# Altium schematic sheet Dev_Board.SchDoc
size B; SheetNumber: 1; SheetTotal: 1
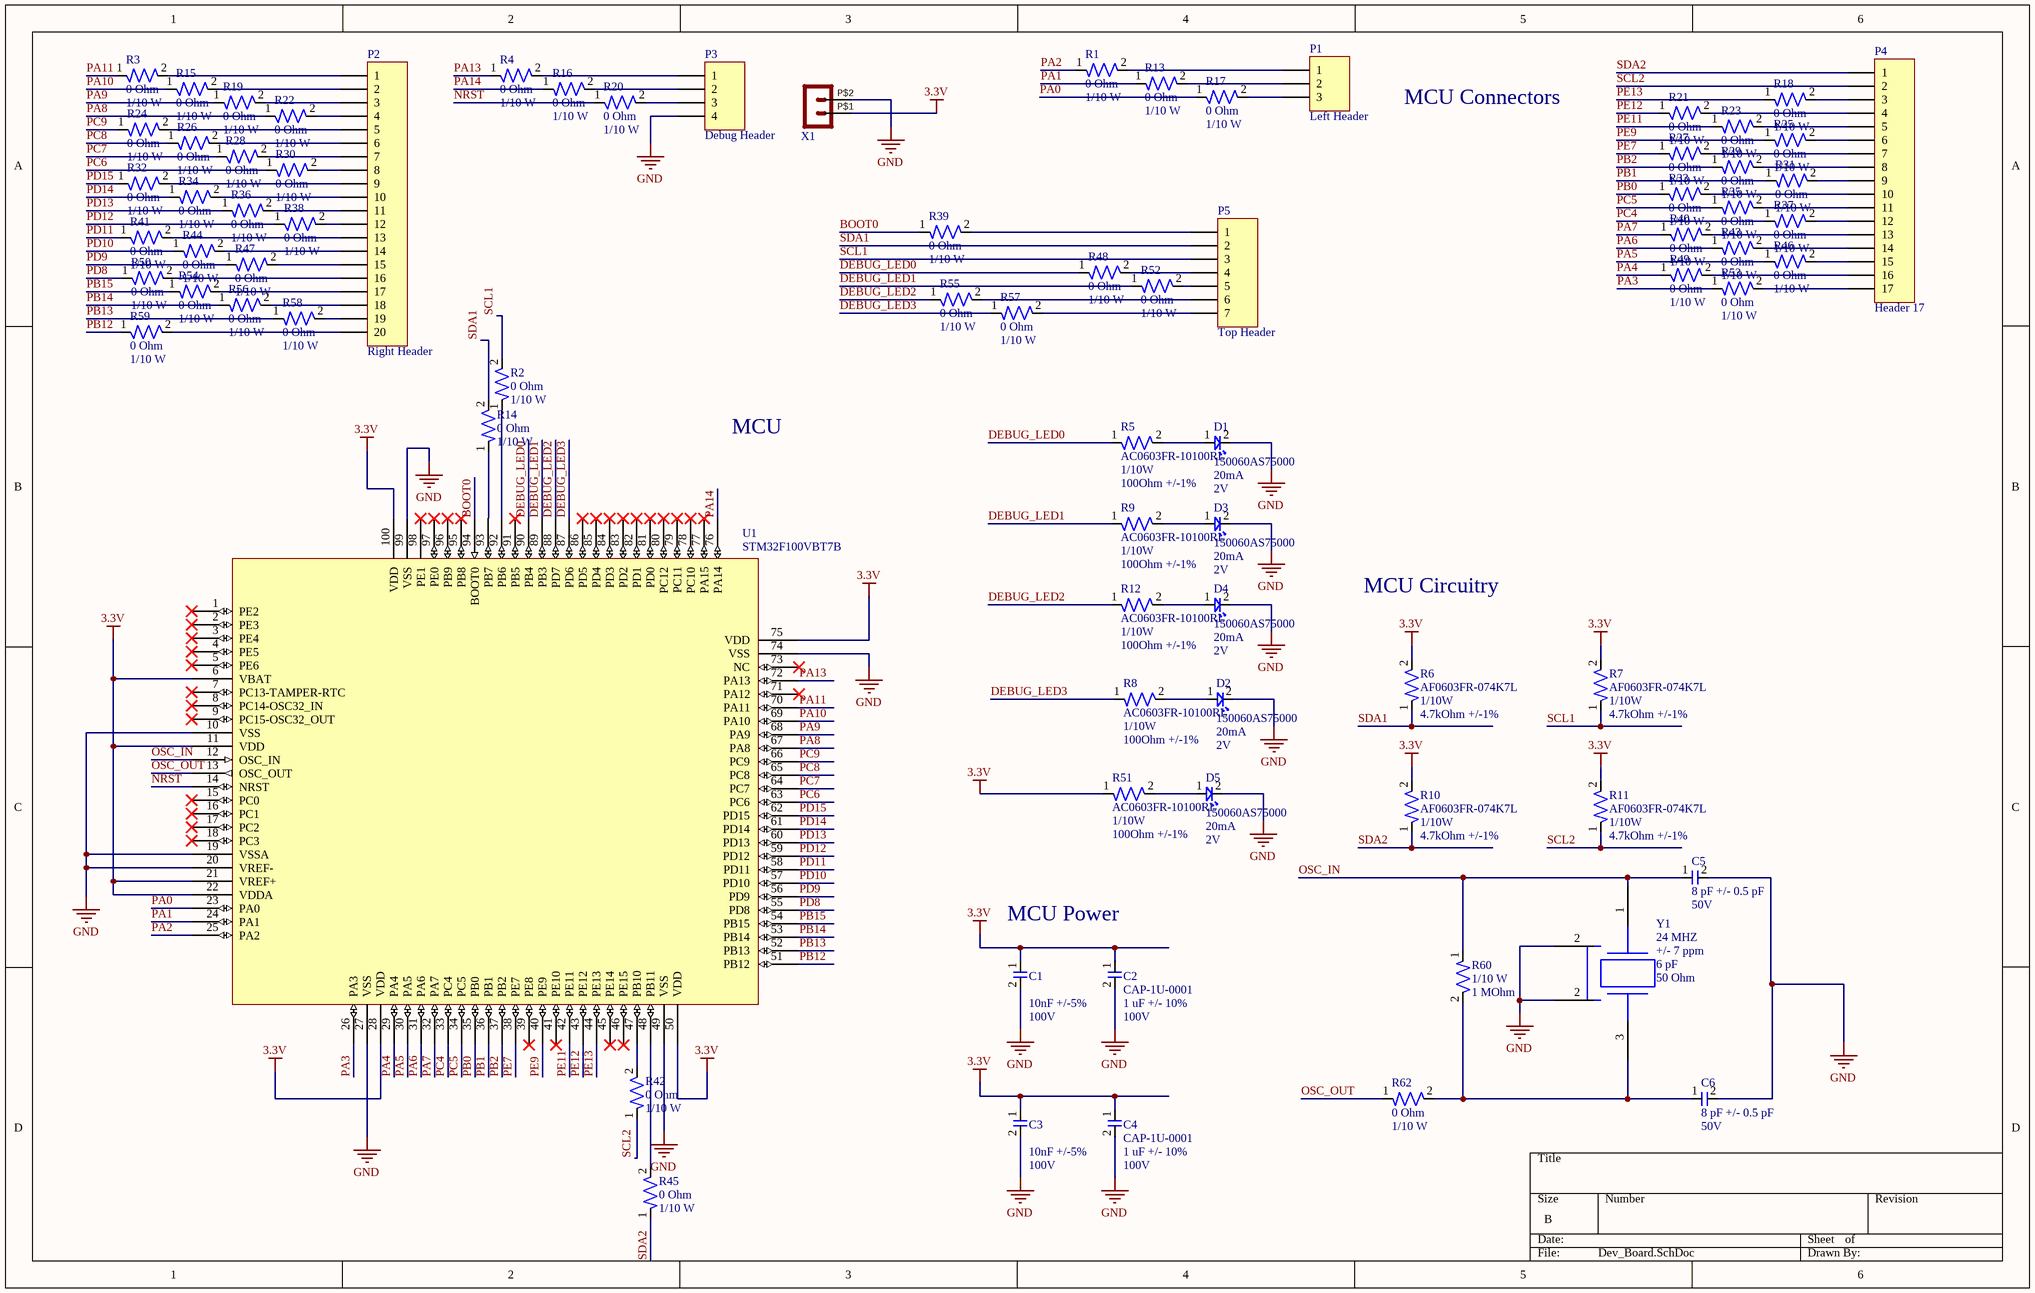
[diagram p0: Dev_Board.SchDoc]

## Parts
C1  Capacitance: 10nF +/-5%  Voltage Rating: 100V  [CAP-0603]  (hidden comment: C1608C0G2A103J080AC)
C2  CAP-1U-0001  Capacitance: 1 uF +/- 10%  Voltage: 100V  [CAP-1206 - duplicate]
C3  Capacitance: 10nF +/-5%  Voltage Rating: 100V  [CAP-0603]  (hidden comment: C1608C0G2A103J080AC)
C4  CAP-1U-0001  Capacitance: 1 uF +/- 10%  Voltage: 100V  [CAP-1206 - duplicate]
C5  Capacitance: 8 pF +/- 0.5 pF  Voltage: 50V  [CAP-0603]  (hidden comment: CC0603DRNPO9BN8R0)
C6  Capacitance: 8 pF +/- 0.5 pF  Voltage: 50V  [CAP-0603]  (hidden comment: CC0603DRNPO9BN8R0)
D1  150060AS75000  Current Rating: 20mA  Vf: 2V  [LED-0603]
D2  150060AS75000  Current Rating: 20mA  Vf: 2V  [LED-0603]
D3  150060AS75000  Current Rating: 20mA  Vf: 2V  [LED-0603]
D4  150060AS75000  Current Rating: 20mA  Vf: 2V  [LED-0603]
D5  150060AS75000  Current Rating: 20mA  Vf: 2V  [LED-0603]
P1  Left Header  [HDR1X3]
P2  Right Header  [HDR1X20]
P3  Debug Header  [HDR1X4]
P4  Header 17  [HDR1X17]
P5  Top Header  [HDR1X7]
R1  Resistance: 0 Ohm  Power: 1/10 W  [RES-0603]  (hidden comment: RMCF0603ZT0R00)
R2  Resistance: 0 Ohm  Power: 1/10 W  [RES-0603]  (hidden comment: RMCF0603ZT0R00)
R3  Resistance: 0 Ohm  Power: 1/10 W  [RES-0603]  (hidden comment: RMCF0603ZT0R00)
R4  Resistance: 0 Ohm  Power: 1/10 W  [RES-0603]  (hidden comment: RMCF0603ZT0R00)
R5  AC0603FR-10100RL  Power Rating: 1/10W  Resistance: 100Ohm +/-1%  [RES-0603]
R6  AF0603FR-074K7L  Power Rating: 1/10W  Resistance: 4.7kOhm +/-1%  [RES-0603]
R7  AF0603FR-074K7L  Power Rating: 1/10W  Resistance: 4.7kOhm +/-1%  [RES-0603]
R8  AC0603FR-10100RL  Power Rating: 1/10W  Resistance: 100Ohm +/-1%  [RES-0603]
R9  AC0603FR-10100RL  Power Rating: 1/10W  Resistance: 100Ohm +/-1%  [RES-0603]
R10  AF0603FR-074K7L  Power Rating: 1/10W  Resistance: 4.7kOhm +/-1%  [RES-0603]
R11  AF0603FR-074K7L  Power Rating: 1/10W  Resistance: 4.7kOhm +/-1%  [RES-0603]
R12  AC0603FR-10100RL  Power Rating: 1/10W  Resistance: 100Ohm +/-1%  [RES-0603]
R13  Resistance: 0 Ohm  Power: 1/10 W  [RES-0603]  (hidden comment: RMCF0603ZT0R00)
R14  Resistance: 0 Ohm  Power: 1/10 W  [RES-0603]  (hidden comment: RMCF0603ZT0R00)
R15  Resistance: 0 Ohm  Power: 1/10 W  [RES-0603]  (hidden comment: RMCF0603ZT0R00)
R16  Resistance: 0 Ohm  Power: 1/10 W  [RES-0603]  (hidden comment: RMCF0603ZT0R00)
R17  Resistance: 0 Ohm  Power: 1/10 W  [RES-0603]  (hidden comment: RMCF0603ZT0R00)
R18  Resistance: 0 Ohm  Power: 1/10 W  [RES-0603]  (hidden comment: RMCF0603ZT0R00)
R19  Resistance: 0 Ohm  Power: 1/10 W  [RES-0603]  (hidden comment: RMCF0603ZT0R00)
R20  Resistance: 0 Ohm  Power: 1/10 W  [RES-0603]  (hidden comment: RMCF0603ZT0R00)
R21  Resistance: 0 Ohm  Power: 1/10 W  [RES-0603]  (hidden comment: RMCF0603ZT0R00)
R22  Resistance: 0 Ohm  Power: 1/10 W  [RES-0603]  (hidden comment: RMCF0603ZT0R00)
R23  Resistance: 0 Ohm  Power: 1/10 W  [RES-0603]  (hidden comment: RMCF0603ZT0R00)
R24  Resistance: 0 Ohm  Power: 1/10 W  [RES-0603]  (hidden comment: RMCF0603ZT0R00)
R25  Resistance: 0 Ohm  Power: 1/10 W  [RES-0603]  (hidden comment: RMCF0603ZT0R00)
R26  Resistance: 0 Ohm  Power: 1/10 W  [RES-0603]  (hidden comment: RMCF0603ZT0R00)
R27  Resistance: 0 Ohm  Power: 1/10 W  [RES-0603]  (hidden comment: RMCF0603ZT0R00)
R28  Resistance: 0 Ohm  Power: 1/10 W  [RES-0603]  (hidden comment: RMCF0603ZT0R00)
R29  Resistance: 0 Ohm  Power: 1/10 W  [RES-0603]  (hidden comment: RMCF0603ZT0R00)
R30  Resistance: 0 Ohm  Power: 1/10 W  [RES-0603]  (hidden comment: RMCF0603ZT0R00)
R31  Resistance: 0 Ohm  Power: 1/10 W  [RES-0603]  (hidden comment: RMCF0603ZT0R00)
R32  Resistance: 0 Ohm  Power: 1/10 W  [RES-0603]  (hidden comment: RMCF0603ZT0R00)
R33  Resistance: 0 Ohm  Power: 1/10 W  [RES-0603]  (hidden comment: RMCF0603ZT0R00)
R34  Resistance: 0 Ohm  Power: 1/10 W  [RES-0603]  (hidden comment: RMCF0603ZT0R00)
R35  Resistance: 0 Ohm  Power: 1/10 W  [RES-0603]  (hidden comment: RMCF0603ZT0R00)
R36  Resistance: 0 Ohm  Power: 1/10 W  [RES-0603]  (hidden comment: RMCF0603ZT0R00)
R37  Resistance: 0 Ohm  Power: 1/10 W  [RES-0603]  (hidden comment: RMCF0603ZT0R00)
R38  Resistance: 0 Ohm  Power: 1/10 W  [RES-0603]  (hidden comment: RMCF0603ZT0R00)
R39  Resistance: 0 Ohm  Power: 1/10 W  [RES-0603]  (hidden comment: RMCF0603ZT0R00)
R40  Resistance: 0 Ohm  Power: 1/10 W  [RES-0603]  (hidden comment: RMCF0603ZT0R00)
R41  Resistance: 0 Ohm  Power: 1/10 W  [RES-0603]  (hidden comment: RMCF0603ZT0R00)
R42  Resistance: 0 Ohm  Power: 1/10 W  [RES-0603]  (hidden comment: RMCF0603ZT0R00)
R43  Resistance: 0 Ohm  Power: 1/10 W  [RES-0603]  (hidden comment: RMCF0603ZT0R00)
R44  Resistance: 0 Ohm  Power: 1/10 W  [RES-0603]  (hidden comment: RMCF0603ZT0R00)
R45  Resistance: 0 Ohm  Power: 1/10 W  [RES-0603]  (hidden comment: RMCF0603ZT0R00)
R46  Resistance: 0 Ohm  Power: 1/10 W  [RES-0603]  (hidden comment: RMCF0603ZT0R00)
R47  Resistance: 0 Ohm  Power: 1/10 W  [RES-0603]  (hidden comment: RMCF0603ZT0R00)
R48  Resistance: 0 Ohm  Power: 1/10 W  [RES-0603]  (hidden comment: RMCF0603ZT0R00)
R49  Resistance: 0 Ohm  Power: 1/10 W  [RES-0603]  (hidden comment: RMCF0603ZT0R00)
R50  Resistance: 0 Ohm  Power: 1/10 W  [RES-0603]  (hidden comment: RMCF0603ZT0R00)
R51  AC0603FR-10100RL  Power Rating: 1/10W  Resistance: 100Ohm +/-1%  [RES-0603]
R52  Resistance: 0 Ohm  Power: 1/10 W  [RES-0603]  (hidden comment: RMCF0603ZT0R00)
R53  Resistance: 0 Ohm  Power: 1/10 W  [RES-0603]  (hidden comment: RMCF0603ZT0R00)
R54  Resistance: 0 Ohm  Power: 1/10 W  [RES-0603]  (hidden comment: RMCF0603ZT0R00)
R55  Resistance: 0 Ohm  Power: 1/10 W  [RES-0603]  (hidden comment: RMCF0603ZT0R00)
R56  Resistance: 0 Ohm  Power: 1/10 W  [RES-0603]  (hidden comment: RMCF0603ZT0R00)
R57  Resistance: 0 Ohm  Power: 1/10 W  [RES-0603]  (hidden comment: RMCF0603ZT0R00)
R58  Resistance: 0 Ohm  Power: 1/10 W  [RES-0603]  (hidden comment: RMCF0603ZT0R00)
R59  Resistance: 0 Ohm  Power: 1/10 W  [RES-0603]  (hidden comment: RMCF0603ZT0R00)
R60  Power: 1/10 W  Resistance: 1 MOhm  [RES-0603]  (hidden comment: RMCF0603FT1M00)
R62  Resistance: 0 Ohm  Power: 1/10 W  [RES-0603]  (hidden comment: RMCF0603ZT0R00)
U1  STM32F100VBT7B  [IC-STM32F100-0001]
X1  Molex - Micro-Fit 3.0 Series connector,  3.00mm (0.118") pitch header, 2 positions.  [43650-0200]  (value not drawn)
Y1  Frequency: 24 MHZ  Frequency Tolerance: +/- 7 ppm  Load Capacitance: 6 pF  Equavalence Series Resistance: 50 Ohm  [CRYSTAL-4-SMD-0001]  (hidden comment: ECS-240-6-37B-7KM-TR)

## Nets
3.3V: C1.1 C2.1 C3.1 C4.1 R6.2 R7.2 R10.2 R11.2 R51.1 U1.6(VBAT) U1.11(VDD) U1.21(VREF+) U1.22(VDDA) U1.28(VDD) U1.50(VDD) U1.75(VDD) U1.100(VDD) X1.P$1
GND: C1.2 C2.2 C3.2 C4.2 C5.2 C6.2 D1.2 D2.2 D3.2 D4.2 D5.2 P3.4 U1.10(VSS) U1.19(VSSA) U1.20(VREF-) U1.27(VSS) U1.49(VSS) U1.74(VSS) U1.99(VSS) X1.P$2 Y1.2
BOOT0: R39.1 U1.94(BOOT0)
DEBUG_LED0: R5.1 R48.1 U1.90(PB4)
DEBUG_LED1: R9.1 R52.1 U1.89(PB3)
DEBUG_LED2: R12.1 R55.1 U1.88(PD7)
DEBUG_LED3: R8.1 R57.1 U1.87(PD6)
NRST: R20.1 U1.14(NRST)
OSC_IN: C5.1 R60.1 U1.12(OSC_IN) Y1.1
OSC_OUT: R62.1 U1.13(OSC_OUT)
PA0: R17.1 U1.23(PA0)
PA1: R13.1 U1.24(PA1)
PA2: R1.1 U1.25(PA2)
PA3: R53.1 U1.26(PA3)
PA4: R49.1 U1.29(PA4)
PA5: R46.1 U1.30(PA5)
PA6: R43.1 U1.31(PA6)
PA7: R40.1 U1.32(PA7)
PA8: R22.1 U1.67(PA8)
PA9: R19.1 U1.68(PA9)
PA10: R15.1 U1.69(PA10)
PA11: R3.1 U1.70(PA11)
PA13: R4.1 U1.72(PA13)
PA14: R16.1 U1.76(PA14)
PB0: R33.1 U1.35(PB0)
PB1: R31.1 U1.36(PB1)
PB2: R29.1 U1.37(PB2)
PB12: R59.1 U1.51(PB12)
PB13: R58.1 U1.52(PB13)
PB14: R56.1 U1.53(PB14)
PB15: R54.1 U1.54(PB15)
PC4: R37.1 U1.33(PC4)
PC5: R35.1 U1.34(PC5)
PC6: R30.1 U1.63(PC6)
PC7: R28.1 U1.64(PC7)
PC8: R26.1 U1.65(PC8)
PC9: R24.1 U1.66(PC9)
PD8: R50.1 U1.55(PD8)
PD9: R47.1 U1.56(PD9)
PD10: R44.1 U1.57(PD10)
PD11: R41.1 U1.58(PD11)
PD12: R38.1 U1.59(PD12)
PD13: R36.1 U1.60(PD13)
PD14: R34.1 U1.61(PD14)
PD15: R32.1 U1.62(PD15)
PE7: R27.1 U1.38(PE7)
PE9: R25.1 U1.40(PE9)
PE11: R23.1 U1.42(PE11)
PE12: R21.1 U1.43(PE12)
PE13: R18.1 U1.44(PE13)
SCL1: P5.3 R2.2 R7.1
SCL2: P4.2 R11.1 R42.1
SDA1: P5.2 R6.1 R14.2
SDA2: P4.1 R10.1 R45.1
NetC6_1: C6.1 R60.2 R62.2 Y1.3
NetD1_1: D1.1 R5.2
NetD2_1: D2.1 R8.2
NetD3_1: D3.1 R9.2
NetD4_1: D4.1 R12.2
NetD5_1: D5.1 R51.2
NetP1_1: P1.1 R1.2
NetP1_2: P1.2 R13.2
NetP1_3: P1.3 R17.2
NetP2_1: P2.1 R3.2
NetP2_2: P2.2 R15.2
NetP2_3: P2.3 R19.2
NetP2_4: P2.4 R22.2
NetP2_5: P2.5 R24.2
NetP2_6: P2.6 R26.2
NetP2_7: P2.7 R28.2
NetP2_8: P2.8 R30.2
NetP2_9: P2.9 R32.2
NetP2_10: P2.10 R34.2
NetP2_11: P2.11 R36.2
NetP2_12: P2.12 R38.2
NetP2_13: P2.13 R41.2
NetP2_14: P2.14 R44.2
NetP2_15: P2.15 R47.2
NetP2_16: P2.16 R50.2
NetP2_17: P2.17 R54.2
NetP2_18: P2.18 R56.2
NetP2_19: P2.19 R58.2
NetP2_20: P2.20 R59.2
NetP3_1: P3.1 R4.2
NetP3_2: P3.2 R16.2
NetP3_3: P3.3 R20.2
NetP4_3: P4.3 R18.2
NetP4_4: P4.4 R21.2
NetP4_5: P4.5 R23.2
NetP4_6: P4.6 R25.2
NetP4_7: P4.7 R27.2
NetP4_8: P4.8 R29.2
NetP4_9: P4.9 R31.2
NetP4_10: P4.10 R33.2
NetP4_11: P4.11 R35.2
NetP4_12: P4.12 R37.2
NetP4_13: P4.13 R40.2
NetP4_14: P4.14 R43.2
NetP4_15: P4.15 R46.2
NetP4_16: P4.16 R49.2
NetP4_17: P4.17 R53.2
NetP5_1: P5.1 R39.2
NetP5_4: P5.4 R48.2
NetP5_5: P5.5 R52.2
NetP5_6: P5.6 R55.2
NetP5_7: P5.7 R57.2
NetR2_1: R2.1 U1.92(PB6)
NetR14_1: R14.1 U1.93(PB7)
NetR42_2: R42.2 U1.47(PB10)
NetR45_2: R45.2 U1.48(PB11)

Not connected (* = marked no-connect by the designer): U1 1(PE2)* 2(PE3)* 3(PE4)* 4(PE5)* 5(PE6)* 7(PC13-TAMPER-RTC)* 8(PC14-OSC32_IN)* 9(PC15-OSC32_OUT)* 15(PC0)* 16(PC1)* 17(PC2)* 18(PC3)* 39(PE8)* 41(PE10)* 45(PE14)* 46(PE15)* 71(PA12)* 73(NC)* 77(PA15)* 78(PC10)* 79(PC11)* 80(PC12)* 81(PD0)* 82(PD1)* 83(PD2)* 84(PD3)* 85(PD4)* 86(PD5)* 91(PB5)* 95(PB8)* 96(PB9)* 97(PE0)* 98(PE1)*

## Notes on the sheet
- MCU Connectors
- MCU
- MCU Circuitry
- MCU Power

## Library data of the parts
C1 C3 = CAP-10N-0002: CAP CER 10000PF 100V C0G 0603; Manufacturer: TDK Corporation; Temperature Coefficient: C0G/NP0; Assembled?: no; Manufacturer Part Number: C1608C0G2A103J080AC; Package Size: 0603
C2 C4 = CAP-1U-0001: 1 µF ±10% 100V Ceramic Capacitor X7R 1206 (3216 Metric)
C5 C6 = CAP-8P-0001: 8 pF ±0.5pF 50V Ceramic Capacitor C0G, NP0 0603 (1608 Metric); Package Size: 0603
D1-D5 = LED_Amber_0001: CAP CER 0.1UF 100V X7R 0603; Manufacturer: Wurth Electronik; Assembled?: no; Color: Amber; Manufacturer Part Number: 150060AS75000; Package Size: 0603
P1 = Header 3: Header, 3-Pin; LatestRevisionDate: 17-Jul-2002; LatestRevisionNote: Re-released for DXP Platform.; Publisher: Altium Limited
P2 = Header 20: Header, 20-Pin; LatestRevisionDate: 17-Jul-2002; LatestRevisionNote: Re-released for DXP Platform.; Publisher: Altium Limited
P3 = Header 4: Header, 4-Pin; LatestRevisionDate: 17-Jul-2002; LatestRevisionNote: Re-released for DXP Platform.; Publisher: Altium Limited
P4 = Header 17: Header, 17-Pin; LatestRevisionDate: 17-Jul-2002; LatestRevisionNote: Re-released for DXP Platform.; Publisher: Altium Limited
P5 = Header 7: Header, 7-Pin; LatestRevisionDate: 17-Jul-2002; LatestRevisionNote: Re-released for DXP Platform.; Publisher: Altium Limited
R1-R4 R13-R50 R52-R59 R62 = RES-0-0001: 0 Ohms Jumper 0.1W, 1/10W Chip Resistor 0603 (1608 Metric) Automotive AEC-Q200 Thick Film; Package Size: 0603
R5 R8 R9 R12 R51 = RES-100-0002: RESISTOR SMD; Manufacturer: YAGEO; Assembled?: no; Manufacturer Part Number: AC0603FR-10100RL; Package Size: 0603
R6 R7 R10 R11 = RES-4.7K-0002: RES SMD 4.7K OHM 1% 1/10W 0603; Manufacturer: YAGEO; Assembled?: no; Manufacturer Part Number: AF0603FR-074K7L; Package Size: 0603
R60 = RES-1M-0001: 1 MOhms ±1% 0.1W, 1/10W Chip Resistor 0603 (1608 Metric) Automotive AEC-Q200 Thick Film; Package Size: 0603
U1 = IC-STM32F100-0001: ARM® Cortex®-M3 STM32F1 Microcontroller IC 32-Bit Single-Core 24MHz 128KB (128K x 8) FLASH 100-LQFP (14x14); VCC: 2 ~ 3.6V; Manufacturer Part Number: STM32F100VBT7B; Package Size: 100-LQFP
X1 = HEADER_POS2_?43650-0200
Y1 = CRYSTAL-24MHz-0001: 24 MHz ±7ppm Crystal 6pF 50 Ohms 4-SMD, No Lead; Manufacturer: ECS Inc.; Manufacturer Part Number: ECS-240-6-37B-7KM-TR; Package Size: 4-SMD